# Altium schematic sheet Coil_Driver_Rev_A-3V_PCH-1.SchDoc: 3.3V, PCH
size B; Author: KR; DocumentNumber: 12282021; Revision: A; SheetNumber: 2; SheetTotal: 3; PageSetup: Record=PageOptions|CenterHorizontal=True|CenterVertical=True|PrintScale=0.95|XCorrection=1.00|YCorrection=1.00|PrintKind=1|BorderSize=5000000|LeftOffset=0|BottomOffset=0|Orientation=2|PaperLength=1000|PaperWidth=1000|Scale=100|PaperSource=7|PrintQuality=-4|MediaType=1|DitherType=10|PaperKind=Letter|PrintScaleMode=1
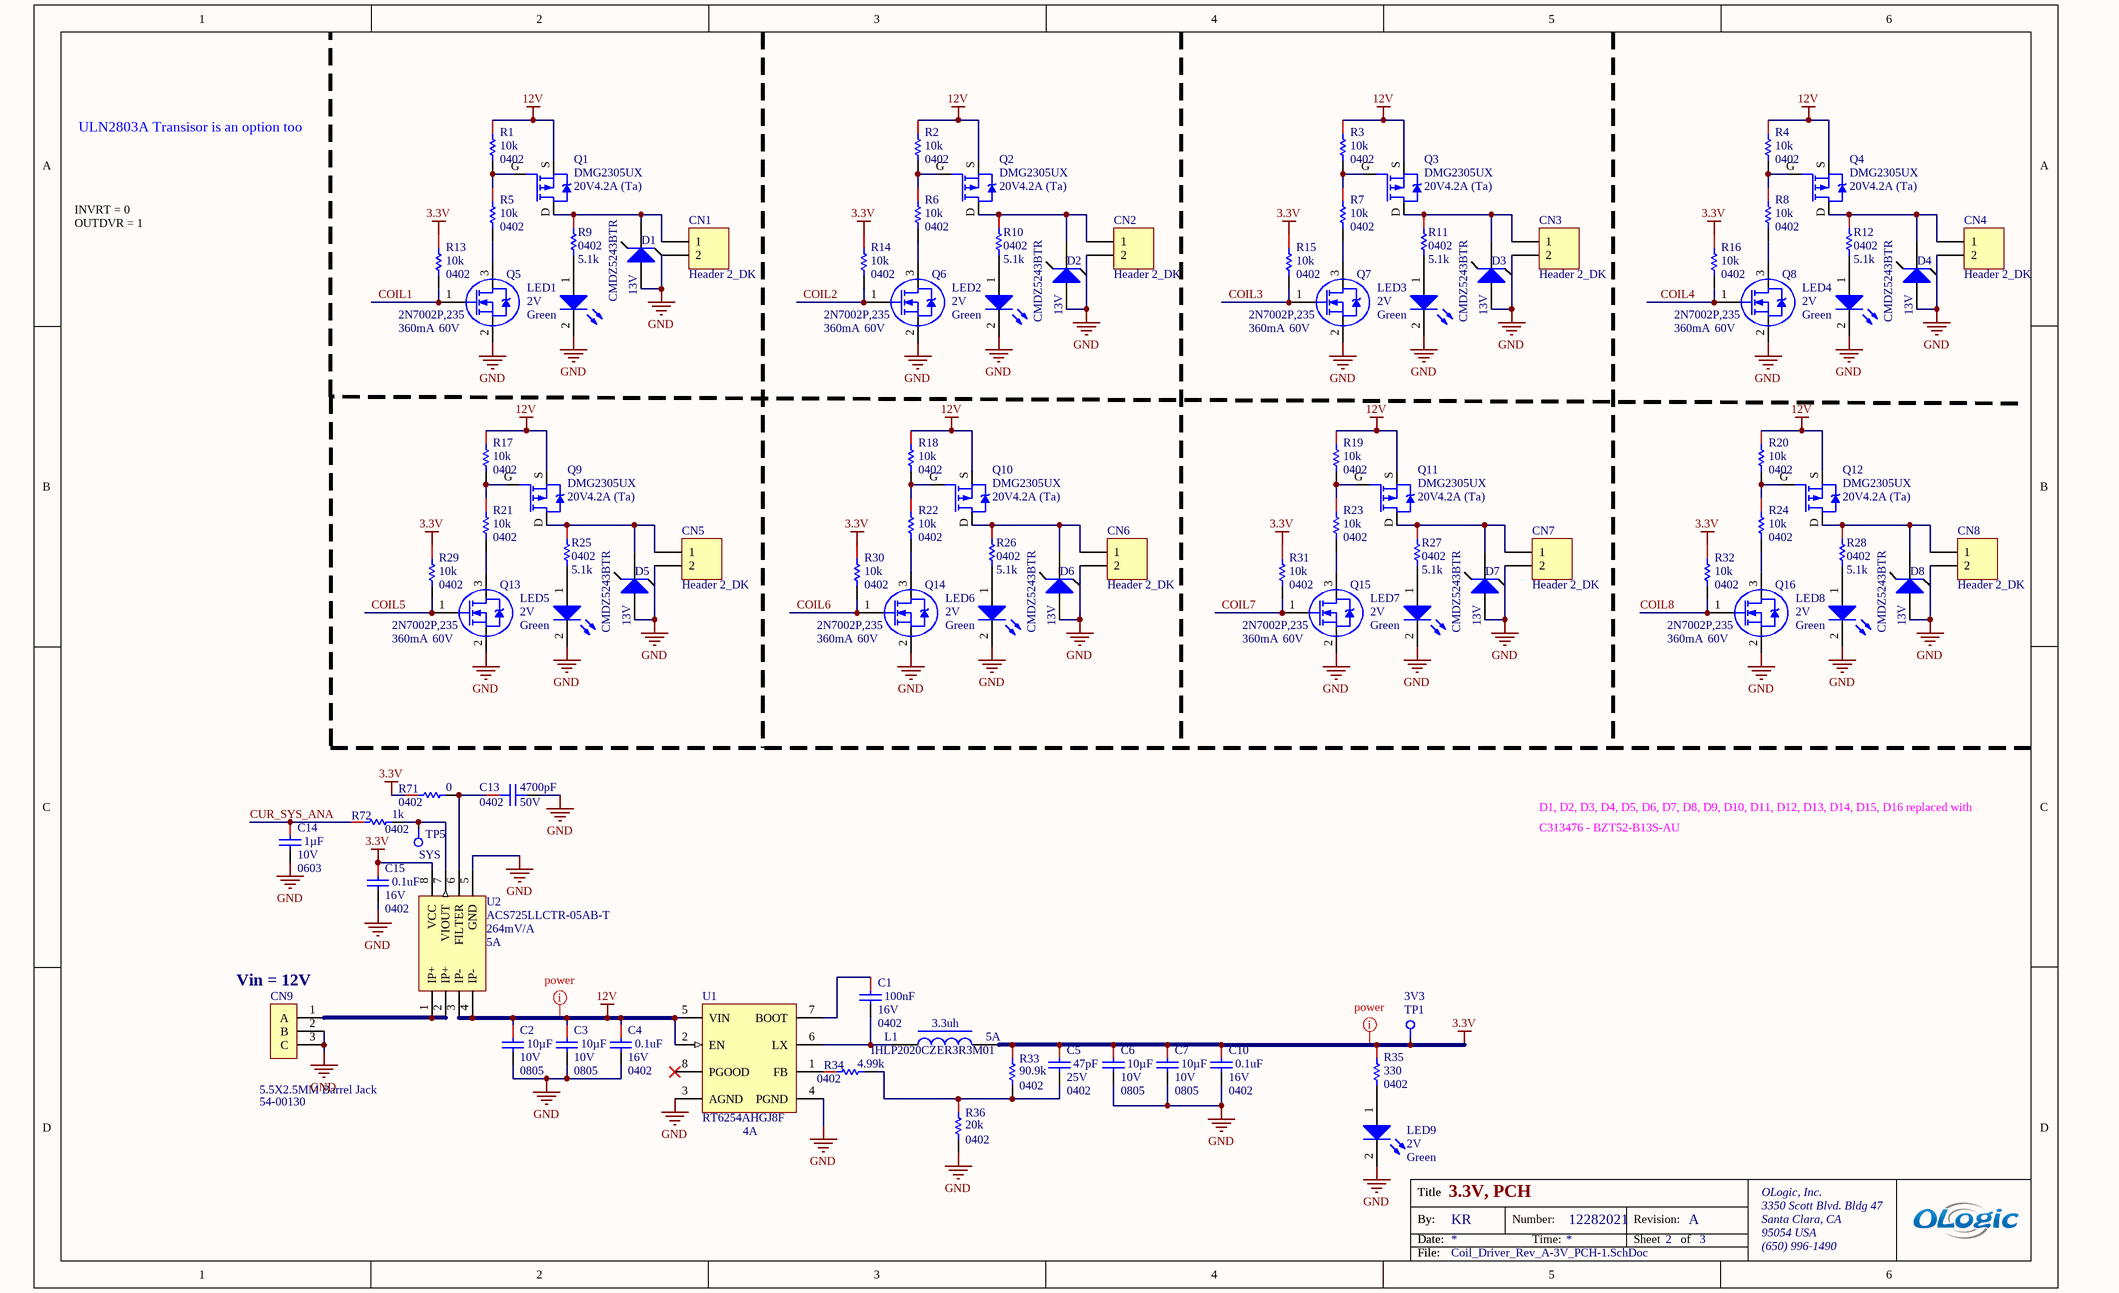
[diagram p0: Coil_Driver_Rev_A-3V_PCH-1.SchDoc]

## Parts
C1  Voltage (Rated): 16V  Package (Imperial): 0402  Capacitance: 100nF  [CAPC0402(1005)_L]  (hidden comment: CAP CER 0.1UF 16V X5R 0402)
C2  Voltage (Rated): 10V  Package (Imperial): 0805  Capacitance: 10µF  [CAPC0805(2012)_L]  (hidden comment: CAP CER 10UF 10V X7R 0805)
C3  Voltage (Rated): 10V  Package (Imperial): 0805  Capacitance: 10µF  [CAPC0805(2012)_L]  (hidden comment: CAP CER 10UF 10V X7R 0805)
C4  Package (Imperial): 0402  Voltage (Rated): 16V  Capacitance: 0.1uF  [CAPC0402(1005)_L]  (hidden comment: CAP CER 0.1UF 16V X5R 0402)
C5  Package (Imperial): 0402  Voltage (Rated): 25V  Capacitance: 47pF  [CAPC0402(1005)_L]  (hidden comment: CAP CER 47PF 25V C0G/NP0 0402)
C6  Voltage (Rated): 10V  Package (Imperial): 0805  Capacitance: 10µF  [CAPC0805(2012)_L]  (hidden comment: CAP CER 10UF 10V X7R 0805)
C7  Voltage (Rated): 10V  Package (Imperial): 0805  Capacitance: 10µF  [CAPC0805(2012)_L]  (hidden comment: CAP CER 10UF 10V X7R 0805)
C10  Package (Imperial): 0402  Voltage (Rated): 16V  Capacitance: 0.1uF  [CAPC0402(1005)_L]  (hidden comment: CAP CER 0.1UF 16V X5R 0402)
C13  4700pF  Voltage (Rated): 50V  Package (Imperial): 0402  [CAPC0402(1005)_N]
C14  Capacitance: 1µF  Voltage (Rated): 10V  Package (Imperial): 0603  [CAPC0603(1608)_L]  (hidden comment: 1uF)
C15  0.1uF  Voltage (Rated): 16V  Package (Imperial): 0402  [CAPC0402(1005)_L]
CN1  Header 2_DK  [HDR1X2]
CN2  Header 2_DK  [HDR1X2]
CN3  Header 2_DK  [HDR1X2]
CN4  Header 2_DK  [HDR1X2]
CN5  Header 2_DK  [HDR1X2]
CN6  Header 2_DK  [HDR1X2]
CN7  Header 2_DK  [HDR1X2]
CN8  Header 2_DK  [HDR1X2]
CN9  5.5X2.5MM Barrel Jack  [54-00130]
D1  CMDZ5243BTR  Zener Voltage: 13V  [SOD-323]
D2  CMDZ5243BTR  Zener Voltage: 13V  [SOD-323]
D3  CMDZ5243BTR  Zener Voltage: 13V  [SOD-323]
D4  CMDZ5243BTR  Zener Voltage: 13V  [SOD-323]
D5  CMDZ5243BTR  Zener Voltage: 13V  [SOD-323]
D6  CMDZ5243BTR  Zener Voltage: 13V  [SOD-323]
D7  CMDZ5243BTR  Zener Voltage: 13V  [SOD-323]
D8  CMDZ5243BTR  Zener Voltage: 13V  [SOD-323]
L1  IHLP2020CZER3R3M01  Inductance: 3.3uh  Current Rating: 5A  [INDP5252X30N]
LED1  Voltage - Forward (Vf) (Typ): 2V  Color: Green  [SM-LED-0603]  (hidden comment: LTST-C191KGKT)
LED2  Voltage - Forward (Vf) (Typ): 2V  Color: Green  [SM-LED-0603]  (hidden comment: LTST-C191KGKT)
LED3  Voltage - Forward (Vf) (Typ): 2V  Color: Green  [SM-LED-0603]  (hidden comment: LTST-C191KGKT)
LED4  Voltage - Forward (Vf) (Typ): 2V  Color: Green  [SM-LED-0603]  (hidden comment: LTST-C191KGKT)
LED5  Voltage - Forward (Vf) (Typ): 2V  Color: Green  [SM-LED-0603]  (hidden comment: LTST-C191KGKT)
LED6  Voltage - Forward (Vf) (Typ): 2V  Color: Green  [SM-LED-0603]  (hidden comment: LTST-C191KGKT)
LED7  Voltage - Forward (Vf) (Typ): 2V  Color: Green  [SM-LED-0603]  (hidden comment: LTST-C191KGKT)
LED8  Voltage - Forward (Vf) (Typ): 2V  Color: Green  [SM-LED-0603]  (hidden comment: LTST-C191KGKT)
LED9  Voltage - Forward (Vf) (Typ): 2V  Color: Green  [SM-LED-0603]  (hidden comment: LTST-C191KGKT)
Q1  DMG2305UX  Current - Continuous Drain (Id) @ 25°C: 4.2A (Ta)  Drain to Source Voltage (Vdss): 20V  [DMG2305UX-7]
Q2  DMG2305UX  Current - Continuous Drain (Id) @ 25°C: 4.2A (Ta)  Drain to Source Voltage (Vdss): 20V  [DMG2305UX-7]
Q3  DMG2305UX  Current - Continuous Drain (Id) @ 25°C: 4.2A (Ta)  Drain to Source Voltage (Vdss): 20V  [DMG2305UX-7]
Q4  DMG2305UX  Current - Continuous Drain (Id) @ 25°C: 4.2A (Ta)  Drain to Source Voltage (Vdss): 20V  [DMG2305UX-7]
Q5  2N7002P,235  Continuous Drain Current (ID): 360mA  Drain to Source Voltage (Vdss): 60V  [SOT23-3L]
Q6  2N7002P,235  Continuous Drain Current (ID): 360mA  Drain to Source Voltage (Vdss): 60V  [SOT23-3L]
Q7  2N7002P,235  Continuous Drain Current (ID): 360mA  Drain to Source Voltage (Vdss): 60V  [SOT23-3L]
Q8  2N7002P,235  Continuous Drain Current (ID): 360mA  Drain to Source Voltage (Vdss): 60V  [SOT23-3L]
Q9  DMG2305UX  Current - Continuous Drain (Id) @ 25°C: 4.2A (Ta)  Drain to Source Voltage (Vdss): 20V  [DMG2305UX-7]
Q10  DMG2305UX  Current - Continuous Drain (Id) @ 25°C: 4.2A (Ta)  Drain to Source Voltage (Vdss): 20V  [DMG2305UX-7]
Q11  DMG2305UX  Current - Continuous Drain (Id) @ 25°C: 4.2A (Ta)  Drain to Source Voltage (Vdss): 20V  [DMG2305UX-7]
Q12  DMG2305UX  Current - Continuous Drain (Id) @ 25°C: 4.2A (Ta)  Drain to Source Voltage (Vdss): 20V  [DMG2305UX-7]
Q13  2N7002P,235  Continuous Drain Current (ID): 360mA  Drain to Source Voltage (Vdss): 60V  [SOT23-3L]
Q14  2N7002P,235  Continuous Drain Current (ID): 360mA  Drain to Source Voltage (Vdss): 60V  [SOT23-3L]
Q15  2N7002P,235  Continuous Drain Current (ID): 360mA  Drain to Source Voltage (Vdss): 60V  [SOT23-3L]
Q16  2N7002P,235  Continuous Drain Current (ID): 360mA  Drain to Source Voltage (Vdss): 60V  [SOT23-3L]
R1  Resistance: 10k  Case Code (Imperial): 0402  [RESC0402(1005)_L]  (hidden comment: RES 10K OHM 0.1% 1/16W 0402)
R2  Resistance: 10k  Case Code (Imperial): 0402  [RESC0402(1005)_L]  (hidden comment: RES 10K OHM 0.1% 1/16W 0402)
R3  Resistance: 10k  Case Code (Imperial): 0402  [RESC0402(1005)_L]  (hidden comment: RES 10K OHM 0.1% 1/16W 0402)
R4  Resistance: 10k  Case Code (Imperial): 0402  [RESC0402(1005)_L]  (hidden comment: RES 10K OHM 0.1% 1/16W 0402)
R5  Resistance: 10k  Case Code (Imperial): 0402  [RESC0402(1005)_L]  (hidden comment: RES 10K OHM 0.1% 1/16W 0402)
R6  Resistance: 10k  Case Code (Imperial): 0402  [RESC0402(1005)_L]  (hidden comment: RES 10K OHM 0.1% 1/16W 0402)
R7  Resistance: 10k  Case Code (Imperial): 0402  [RESC0402(1005)_L]  (hidden comment: RES 10K OHM 0.1% 1/16W 0402)
R8  Resistance: 10k  Case Code (Imperial): 0402  [RESC0402(1005)_L]  (hidden comment: RES 10K OHM 0.1% 1/16W 0402)
R9  Package (Imperial): 0402  [RESC0402(1005)_L]  (hidden comment: 5.1K)
R10  Package (Imperial): 0402  [RESC0402(1005)_L]  (hidden comment: 5.1K)
R11  Package (Imperial): 0402  [RESC0402(1005)_L]  (hidden comment: 5.1K)
R12  Package (Imperial): 0402  [RESC0402(1005)_L]  (hidden comment: 5.1K)
R13  Resistance: 10k  Case Code (Imperial): 0402  [RESC0402(1005)_L]  (hidden comment: RES 10K OHM 0.1% 1/16W 0402)
R14  Resistance: 10k  Case Code (Imperial): 0402  [RESC0402(1005)_L]  (hidden comment: RES 10K OHM 0.1% 1/16W 0402)
R15  Resistance: 10k  Case Code (Imperial): 0402  [RESC0402(1005)_L]  (hidden comment: RES 10K OHM 0.1% 1/16W 0402)
R16  Resistance: 10k  Case Code (Imperial): 0402  [RESC0402(1005)_L]  (hidden comment: RES 10K OHM 0.1% 1/16W 0402)
R17  Resistance: 10k  Case Code (Imperial): 0402  [RESC0402(1005)_L]  (hidden comment: RES 10K OHM 0.1% 1/16W 0402)
R18  Resistance: 10k  Case Code (Imperial): 0402  [RESC0402(1005)_L]  (hidden comment: RES 10K OHM 0.1% 1/16W 0402)
R19  Resistance: 10k  Case Code (Imperial): 0402  [RESC0402(1005)_L]  (hidden comment: RES 10K OHM 0.1% 1/16W 0402)
R20  Resistance: 10k  Case Code (Imperial): 0402  [RESC0402(1005)_L]  (hidden comment: RES 10K OHM 0.1% 1/16W 0402)
R21  Resistance: 10k  Case Code (Imperial): 0402  [RESC0402(1005)_L]  (hidden comment: RES 10K OHM 0.1% 1/16W 0402)
R22  Resistance: 10k  Case Code (Imperial): 0402  [RESC0402(1005)_L]  (hidden comment: RES 10K OHM 0.1% 1/16W 0402)
R23  Resistance: 10k  Case Code (Imperial): 0402  [RESC0402(1005)_L]  (hidden comment: RES 10K OHM 0.1% 1/16W 0402)
R24  Resistance: 10k  Case Code (Imperial): 0402  [RESC0402(1005)_L]  (hidden comment: RES 10K OHM 0.1% 1/16W 0402)
R25  Package (Imperial): 0402  [RESC0402(1005)_L]  (hidden comment: 5.1K)
R26  Package (Imperial): 0402  [RESC0402(1005)_L]  (hidden comment: 5.1K)
R27  Package (Imperial): 0402  [RESC0402(1005)_L]  (hidden comment: 5.1K)
R28  Package (Imperial): 0402  [RESC0402(1005)_L]  (hidden comment: 5.1K)
R29  Resistance: 10k  Case Code (Imperial): 0402  [RESC0402(1005)_L]  (hidden comment: RES 10K OHM 0.1% 1/16W 0402)
R30  Resistance: 10k  Case Code (Imperial): 0402  [RESC0402(1005)_L]  (hidden comment: RES 10K OHM 0.1% 1/16W 0402)
R31  Resistance: 10k  Case Code (Imperial): 0402  [RESC0402(1005)_L]  (hidden comment: RES 10K OHM 0.1% 1/16W 0402)
R32  Resistance: 10k  Case Code (Imperial): 0402  [RESC0402(1005)_L]  (hidden comment: RES 10K OHM 0.1% 1/16W 0402)
R33  Package (Imperial): 0402  Resistance: 90.9k  [RESC0402(1005)_L]  (hidden comment: RES 90.9K OHM 1% 1/16W 0402)
R34  Package (Imperial): 0402  [RESC0402(1005)_L]  (hidden comment: 4.99K)
R35  Package (Imperial): 0402  [RESC0402(1005)_L]  (hidden comment: 330)
R36  Package (Imperial): 0402  [RESC0402(1005)_L]  (hidden comment: 20K)
R71  Package (Imperial): 0402  Resistance: 0  [RESC0402(1005)_N]  (no BOM)
R72  Package (Imperial): 0402  [RESC0402(1005)_N]  (hidden comment: 1K)
TP1  3V3  [Pogo-Testpoint]  (no BOM)
TP5  SYS  [Pogo-Testpoint]  (no BOM)
U1  RT6254AHGJ8F  Output Current: 4A  [TSOT-23-8]
U2  ACS725LLCTR-05AB-T  Sensitivity: 264mV/A  Current - Sensing: 5A  [SOG.050/8A]

## Nets
3.3V: C5.1 C6.1 C7.1 C10.1 C15.1 L1.2 R13.1 R14.1 R15.1 R16.1 R29.1 R30.1 R31.1 R32.1 R33.1 R35.1 R71.1 TP1.1 U2.8(VCC)
12V: C2.1 C3.1 C4.1 Q1.S Q2.S Q3.S Q4.S Q9.S Q10.S Q11.S Q12.S R1.1 R2.1 R3.1 R4.1 R17.1 R18.1 R19.1 R20.1 U1.2(EN) U1.5(VIN) U2.3(IP-) U2.4(IP-)
GND: C2.2 C3.2 C4.2 C6.2 C7.2 C10.2 C13.2 C14.2 C15.2 CN1.2 CN2.2 CN3.2 CN4.2 CN5.2 CN6.2 CN7.2 CN8.2 CN9.2(B) CN9.3(C) D1.2(A) D2.2(A) D3.2(A) D4.2(A) D5.2(A) D6.2(A) D7.2(A) D8.2(A) LED1.2(K) LED2.2(K) LED3.2(K) LED4.2(K) LED5.2(K) LED6.2(K) LED7.2(K) LED8.2(K) LED9.2(K) Q5.2(S) Q6.2(S) Q7.2(S) Q8.2(S) Q13.2(S) Q14.2(S) Q15.2(S) Q16.2(S) R36.2 U1.3(AGND) U1.4(PGND) U2.5(GND)
COIL1: Q5.1(G) R13.2
COIL2: Q6.1(G) R14.2
COIL3: Q7.1(G) R15.2
COIL4: Q8.1(G) R16.2
COIL5: Q13.1(G) R29.2
COIL6: Q14.1(G) R30.2
COIL7: Q15.1(G) R31.2
COIL8: Q16.1(G) R32.2
CUR_SYS_ANA: C14.1 R72.1
NetC1_1: C1.1 U1.7(BOOT)
NetC1_2: C1.2 L1.1 U1.6(LX)
NetC5_2: C5.2 R33.2 R34.2 R36.1
NetC13_1: C13.1 R71.2 U2.6(FILTER)
NetCN1_1: CN1.1 D1.1(K) Q1.D R9.1
NetCN2_1: CN2.1 D2.1(K) Q2.D R10.1
NetCN3_1: CN3.1 D3.1(K) Q3.D R11.1
NetCN4_1: CN4.1 D4.1(K) Q4.D R12.1
NetCN5_1: CN5.1 D5.1(K) Q9.D R25.1
NetCN6_1: CN6.1 D6.1(K) Q10.D R26.1
NetCN7_1: CN7.1 D7.1(K) Q11.D R27.1
NetCN8_1: CN8.1 D8.1(K) Q12.D R28.1
NetCN9_1: CN9.1(A) U2.1(IP+) U2.2(IP+)
NetLED1_1: LED1.1(A) R9.2
NetLED2_1: LED2.1(A) R10.2
NetLED3_1: LED3.1(A) R11.2
NetLED4_1: LED4.1(A) R12.2
NetLED5_1: LED5.1(A) R25.2
NetLED6_1: LED6.1(A) R26.2
NetLED7_1: LED7.1(A) R27.2
NetLED8_1: LED8.1(A) R28.2
NetLED9_1: LED9.1(A) R35.2
NetQ1_G: Q1.G R1.2 R5.1
NetQ2_G: Q2.G R2.2 R6.1
NetQ3_G: Q3.G R3.2 R7.1
NetQ4_G: Q4.G R4.2 R8.1
NetQ5_3: Q5.3(D) R5.2
NetQ6_3: Q6.3(D) R6.2
NetQ7_3: Q7.3(D) R7.2
NetQ8_3: Q8.3(D) R8.2
NetQ9_G: Q9.G R17.2 R21.1
NetQ10_G: Q10.G R18.2 R22.1
NetQ11_G: Q11.G R19.2 R23.1
NetQ12_G: Q12.G R20.2 R24.1
NetQ13_3: Q13.3(D) R21.2
NetQ14_3: Q14.3(D) R22.2
NetQ15_3: Q15.3(D) R23.2
NetQ16_3: Q16.3(D) R24.2
NetR34_1: R34.1 U1.1(FB)
NetR72_2: R72.2 TP5.1 U2.7(VIOUT)

Not connected (* = marked no-connect by the designer): U1 8(PGOOD)*

## Layout directives
net class power: 3.3V, 12V

## Notes on the sheet
- ULN2803A Transisor is an option too
- INVRT = 0
  OUTDVR = 1
- D1, D2, D3, D4, D5, D6, D7, D8, D9, D10, D11, D12, D13, D14, D15, D16 replaced with
- C313476 - BZT52-B13S-AU
- (near CN9) Vin = 12V
- Title
- By:
- Date:
- Number:
- Time:
- Revision:
- Sheet
- of
- OLogic, Inc.
- 3350 Scott Blvd. Bldg 47
- Santa Clara, CA
- 95054 USA
- File:
- (650) 996-1490

## Library data of the parts
C1 = CMP-001-0605-17: ±10% 16V Ceramic Capacitor X5R 0402 (1005 Metric); Manufacturer: Taiyo Yuden; Manufacturer Part Number: EMK105BJ104KV-F; Temperature (Min): -55°C; Temperature (Max): 85°C; Package (Metric): 1005; Height: 550µm; Temperature Coefficient: X5R; Tolerance: 10%; Width: 500µm; Mounting Type: SMD; Length: 1mm; Dielectric Material: Ceramic; Supplier: Digi-Key; Supplier Part Number: 587-1226-1-ND
C2 C3 C6 C7 = CMP-001-0889-04: 10µF ±10% 10V Ceramic Capacitor X7R 0805 (2012 Metric); Manufacturer Part Number: GRM21BR71A106KA73K; Package (Metric): 2012; Voltage Rating: 10V; Length: 2mm; Mounting Type: SMD; Height: 1.4mm; Mount: Surface Mount; Case Code (Metric): 2012; Min Operating Temperature: -55°C; Ratings: AEC-Q200; Width: 1.25mm; Packaging: Tape and Reel; Tolerance: 10%; Temperature Coefficient: X7R; Case Code (Imperial): 0805; Max Operating Temperature: 125°C; Case/Package: 0805; Dielectric Material: Ceramic
C4 C10 = CMP-001-0605-17: ±10% 16V Ceramic Capacitor X5R 0402 (1005 Metric); Manufacturer: Taiyo Yuden; Manufacturer Part Number: EMK105BJ104KV-F; Package (Metric): 1005; Temperature (Max): 85°C; Temperature (Min): -55°C; Height: 550µm; Supplier: Digi-Key; Supplier Part Number: 587-1226-1-ND; Tolerance: 10%; Dielectric Material: Ceramic; Temperature Coefficient: X5R; Width: 500µm; Length: 1mm; Mounting Type: SMD
C5 = CMP-001-1119-02: 47pF ±5% 25V Ceramic Capacitor C0G, NP0 0402 (1005 Metric); Manufacturer Part Number: C0402C470J3GACTU; Depth: 0.5mm; Min Operating Temperature: -55°C; Case Code (Metric): 1005; Width: 0.02inch; Thickness: 0.022inch; Lead Pitch: 0.3mm; Max Operating Temperature: 125°C; Length: 1mm; Height: 0.5mm; REACH SVHC: No SVHC; Case/Package: 0402; Package Quantity: 10000; Voltage Rating (DC): 25V; Dielectric Material: Ceramic; Lead Free: Lead Free; Dielectric: C0G; Packaging: Tape and Reel; Termination: SMD/SMT; Radiation Hardening: No; Tolerance: 5%; Mount: Surface Mount; ClassName: 3.3VEXP
C13 = CMP-007-0152-08: CAP CER 4700PF 50V X7R 0402; Capacitance: 4.7nF; Tolerance: 10%; Dielectric Material: Ceramic; Package (Metric): 1005; Temperature Coefficient: X7R; Mounting Type: SMD
C14 = CMP-001-0893-01: PREFERRED (<3.3V): CAP CER 1UF 10V X7R 0603; Dielectric Material: Ceramic; Dissipation Factor: 5%; Package (Metric): 1608; Tolerance: 10%; Depth: 0.8mm; Mount: Surface Mount; Case/Package: 0603; Dielectric: X7R; Case Code (Imperial): 0603; Packaging: Tape and Reel; Case Code (Metric): 1608; Height: 800µm; Contact Plating: Tin,Matte; Package Quantity: 1; Temperature Coefficient: X7R; Max Operating Temperature: 125°C; Termination: SMD/SMT; REACH SVHC: No SVHC; Width: 800µm; Voltage Rating: 10V; Min Operating Temperature: -55°C; Voltage Rating (DC): 10V; Thickness: 0.035inch; Length: 1.6mm; Mounting Type: SMD; Radiation Hardening: No; ClassName: CPU
C15 = CMP-001-0605-16: CAP CER 0.1UF 16v X7R 0402; Temperature (Min): -55°C; Temperature (Max): 85°C; Tolerance: 10%; Capacitance: 100nF; Package (Metric): 1005; Dielectric Material: Ceramic; Height: 500µm; Temperature Coefficient: X7R; Mounting Type: SMD; Length: 1mm
CN1-CN8 = CMP-001-0280-01: Header, 2-Pin; Manufacturer Part Number: 826936-2; Manufacturer: TE Connectivity AMP Connectors; Number of Positions: 2; Connector Type: Header, Unshrouded, Breakaway; Number of Positions Loaded: All; Features: -; Packaging: Bulk; Component Name: Header 2_DK; Color: Green; Stock 1: 32894; ComponentLink1Description: http://www.te.com/commerce/DocumentDelivery/DDEController?Action=srchrtrv&DocNm=826629&DocType=Customer+Drawing&DocLang=English; RoHS: RoHS Compliant; Contact Type: Male Pin; Fastening Type: -; Number of Rows: 1; Designator: Header 2_DK; Termination: Solder; Part Status: Active; ComponentLink1URL: http://www.te.com/commerce/DocumentDelivery/DDEController?Action=srchrtrv&DocNm=826629&DocType=Customer+Drawing&DocLang=English; Contact Finish Thickness: 78.7µin (2.00µm); Pricing 1: 1=0.23, 10=0.211, 25=0.18, 50=0.1576, 100=0.1463, 250=0.12944, 500=0.1238, 1000=0.10129, 2500=0.09284 (USD); Row Spacing: -; Pin Count: 2; Mounting Type: Through Hole; Contact Finish: Tin
CN9 = CMP-001-1647-02: CONN JACK R/A PCB 5.5X2.5MM; Manufacturer: Tensility International Corp; Body Material: Copper Alloy; Voltage Rating: 48V; Shielding: Unshielded; Gender: Male; Current Rating: 6.5A; Housing Material: PBT; Contact Plating: Silver; Packaging: Bulk; Mount: Through Hole; Connector Type: Jack; Max Operating Temperature: 85°C; Manufacturer Part Number: 54-00130; Min Operating Temperature: -25°C; Insulation Color: Black; Termination: Solder; Contact Material: Bronze,Brass
D1-D8 = CMP-001-0939-01: DIODE ZENER 13V 250MW SOD323; Tolerance: 5%; Impedance: 13R; Max Operating Temperature: 150°C; Max Power Dissipation: 250mW; Packaging: Tape and Reel; Min Operating Temperature: -65°C; Mount: Surface Mount
L1 = CMP-001-0659-01: FIXED IND 3.3UH 5A 54.7 MOHM SMD; Tolerance: 20%; Max DC Current: 8.5A; Self Resonant Frequency: 5MHz; Core Material: Composite, Metal; DC Resistance (DCR): 54.7mR; Shielding: Shielded; Test Frequency: 100kHz; Height - Seated (Max): 0.118inch; Inductance Tolerance: 20%; Lead Free: Lead Free; Mount: Surface Mount; Termination: SMD/SMT; Length: 5.74mm; Depth: 5.43mm; Height: 3mm; Packaging: Tape and Reel; Max Operating Temperature: 125°C; Saturation Current: 8.5A; Case/Package: 2020; Military Standard: Not; Package Quantity: 2000; Width: 0.204inch; REACH SVHC: Unknown; Min Operating Temperature: -55°C; Contact Plating: Tin; Radiation Hardening: No; RMS Current (Irms): 5A
LED1-LED8 = CMP-001-0086-07: LED GREEN CLEAR THIN 0603 SMD; Manufacturer: Lite-On Inc; Viewing Angle: 130°; Wavelength - Peak: 574nm; Wavelength - Dominant: 571nm; Current - Test: 20mA; Millicandela Rating: 35mcd; Lens Style/Size: Rectangle with Flat Top, 1.1mm x 0.8mm; Pin Count: 2; Packaging: Cut Tape (CT); Height: 0.55mm; Size / Dimension: 1.60mm L x 0.80mm W; Mounting Type: Surface Mount; ClassName: *; RoHS: RoHS Compliant; Pricing 1: 1=0.3, 10=0.238, 100=0.1296, 250=0.0864, 500=0.07344, 1000=0.05616, 2500=0.05076 (USD); Lens Type: Clear; Manufacturer Part Number: LTST-C191KGKT; Stock 1: 84829; Package / Case: 0603 (1608 Metric)
LED9 = CMP-001-0086-06: LED GREEN CLEAR THIN 0603 SMD; Manufacturer: Lite-On Inc; Viewing Angle: 130°; Wavelength - Peak: 574nm; Wavelength - Dominant: 571nm; Current - Test: 20mA; Millicandela Rating: 35mcd; Lens Style/Size: Rectangle with Flat Top, 1.1mm x 0.8mm; Pin Count: 2; Packaging: Cut Tape (CT); Height: 0.55mm; Size / Dimension: 1.60mm L x 0.80mm W; Mounting Type: Surface Mount; ClassName: *; RoHS: RoHS Compliant; Pricing 1: 1=0.3, 10=0.238, 100=0.1296, 250=0.0864, 500=0.07344, 1000=0.05616, 2500=0.05076 (USD); Lens Type: Clear; Manufacturer Part Number: LTST-C191KGKT; Stock 1: 84829; Package / Case: 0603 (1608 Metric)
Q1-Q4 Q9-Q12 = CMP-012-0038-02: MOSFET P-CH 20V 4.2A SOT23; Manufacturer: Diodes Incorporated; Input Capacitance (Ciss) @ Vds: 808pF @ 15V; FET Type: MOSFET P-Channel, Metal Oxide; Power - Max: 1.4W; FET Feature: Standard; Rds On (Max) @ Id, Vgs: 52 mOhm @ 4.2A, 4.5V; Gate Charge (Qg) @ Vgs: 10.2nC @ 4.5V; Vgs(th) (Max) @ Id: 900mV @ 250µA; Manufacturer Part Number: DMG2305UX-7; ComponentLink1URL: http://www.diodes.com/_files/datasheets/DMG2305UX.pdf; ComponentLink1Description: http://www.diodes.com/_files/datasheets/DMG2305UX.pdf; Pricing 1: 1=0.38, 10=0.311, 100=0.1649, 500=0.10846, 1000=0.0739 (USD); Designator: DMG2305UX; Package / Case: TO-236-3, SC-59, SOT-23-3; Supplier Device Package: SOT-23; Component Name: DMG2305UX; Creator: osman; RoHS: RoHS Compliant; Packaging: Cut Tape (CT); Operating Temperature: -55°C ~ 150°C (TJ); Pin Count: 3; Mounting Type: Surface Mount; Stock 1: 78669
Q5-Q8 Q13-Q16 = CMP-012-0002-01: MOSFET N-CH 60V 0.36A SOT-23; Manufacturer: NXP Semiconductors; FET Type: N-Channel; Drain to Source Resistance: 1.6R; Power Dissipation (Max): 350mW (Ta); Gate to Source Voltage (Vgs): 20V; Vgs (Max): ±20V; Turn-Off Delay Time: 10ns; Input Capacitance: 50pF; Current - Continuous Drain (Id) @ 25°C: 360mA (Ta); Max Power Dissipation: 350mW; Drive Voltage (Max Rds On,  Min Rds On): 10V; Rise Time: 4ns; Fall Time: 5ns; Vgs(th) (Max) @ Id: 2.4V @ 250µA; Number of Elements: 1; Power Dissipation: 420mW; Rds On (Max) @ Id, Vgs: 1.6 Ohm @ 500mA, 10V; Turn-On Delay Time: 3ns; ComponentLink7Description: https://datasheet.ciiva.com/15216/getdatasheetpartid-496132-15216636.pdf; ComponentLink2Description: https://datasheet.ciiva.com/4439/2n7002p-99415-4439248.pdf; Contact Plating: Tin; ComponentLink3URL: https://datasheet.ciiva.com/6371/2n7002p-6371141.pdf; Stock 1: 109268; FET Feature: -; Case/Package: SOT; RoHS: RoHS Compliant; ComponentLink2URL: https://datasheet.ciiva.com/4439/2n7002p-99415-4439248.pdf; ComponentLink8URL: https://datasheet.ciiva.com/46633/discretesemiconductors-46633181.pdf; Number of Pins: 3; ComponentLink1Description: http://assets.nexperia.com/documents/data-sheet/2N7002P.pdf; Pricing 1: 1=0.14, 10=0.128, 100=0.07, 500=0.043, 1000=0.0294 (USD); Mounting Type: Surface Mount; Rds On Max: 1.6R; Package Quantity: 10000; Pricing 2: 1=0.16, 10=0.148, 100=0.0969, 500=0.04738, 1000=0.03231 (USD); Lead Free: Lead Free; ComponentLink4Description: https://datasheet.ciiva.com/49067/getdatasheetpartid-765733-49067862.pdf; ComponentLink4URL: https://datasheet.ciiva.com/49067/getdatasheetpartid-765733-49067862.pdf; Packaging: Tape and Reel; Max Dual Supply Voltage: 60V; Part Status: Active; ComponentLink1URL: http://assets.nexperia.com/documents/data-sheet/2N7002P.pdf; ComponentLink7URL: https://datasheet.ciiva.com/15216/getdatasheetpartid-496132-15216636.pdf; Component Name: 2N7002P,235; Pin Count: 3; Operating Temperature: -55°C ~ 150°C (TJ); Stock 2: 177811; ComponentLink3Description: https://datasheet.ciiva.com/6371/2n7002p-6371141.pdf; ComponentLink6Description: https://datasheet.ciiva.com/26921/getdatasheetpartid-765733-26921227.pdf; ComponentLink5Description: https://datasheet.ciiva.com/11168/2n7002p-11168552.pdf; ComponentLink9URL: https://assets.nexperia.com/documents/data-sheet/2N7002P.pdf; ComponentLink8Description: https://datasheet.ciiva.com/46633/discretesemiconductors-46633181.pdf; ComponentLink6URL: https://datasheet.ciiva.com/26921/getdatasheetpartid-765733-26921227.pdf; Package / Case: TO-236-3, SC-59, SOT-23-3; Min Operating Temperature: -55°C; Radiation Hardening: No; ComponentLink5URL: https://datasheet.ciiva.com/11168/2n7002p-11168552.pdf; Manufacturer Part Number: 2N7002P,235; Drain to Source Breakdown Voltage: 60V; Supplier Device Package: TO-236AB (SOT23); Designator: 2N7002P,235; Max Operating Temperature: 150°C; ComponentLink9Description: https://assets.nexperia.com/documents/data-sheet/2N7002P.pdf; Technology: MOSFET (Metal Oxide)
R1-R8 R13-R24 R29-R32 = CMP-001-0950-02: 10 kOhms ±0.1% 0.063W, 1/16W Chip Resistor 0402 (1005 Metric) Automotive AEC-Q200 Thin Film; Temperature Coefficient: 25ppm/°C; Max Power Dissipation: 63mW; Length: 0.039inch; Max Operating Temperature: 155°C; Min Operating Temperature: -55°C; Case/Package: 0402; Packaging: Tape and Reel; Tolerance: 0.1%; Width: 0.02inch; Contact Plating: Tin,Matte; Height: 0.016inch; Composition: Thin Film; Case Code (Metric): 1005; Package Quantity: 10000; Mount: Surface Mount; Radiation Hardening: No; Number of Terminations: 2; Features: Moisture Resistant
R9-R12 R25-R28 = CMP-007-0525-15: RES SMD 5.1K OHM 1% 1/10W 0402; Package (Metric): 1005; Max Power Dissipation: 100mW; Voltage Rating (DC): 50V; Power: 63mW; Temperature Coefficient: 100ppm/°C; Resistance: 5.1k; Termination: SMD/SMT; Lead Free: Lead Free; Mount: Surface Mount; Length: 1mm; Width: 500µm; Min Operating Temperature: -55°C; Contact Plating: Tin; Weight: 2.8E-05oz; Voltage Rating: 50V; Height: 350µm; Depth: 0.5mm; Military Standard: Not; Composition: Thick Film; Number of Terminations: 2; Packaging: Tape and Reel; Power Rating: 100mW; Tolerance: 1%; Package Quantity: 10000; Max Operating Temperature: 155°C; REACH SVHC: No SVHC
R33 = CMP-007-0589-13: 90.9 kOhms ±1% 0.063W, 1/16W Chip Resistor 0402 (1005 Metric) Automotive AEC-Q200 Thick Film; Temperature Coefficient: ±100ppm/°C; Power: 63mW; Package (Metric): 1005; Height: 400µm; Operating Temperature: -55°C ~ 155°C; Tolerance: 1%; Termination: SMD/SMT; Length: 1mm
R34 = CMP-00076-12: RES SMD 4.99K OHM 1% 1/16W 0402; Temperature Coefficient: 100ppm/°C; Power: 63mW; Package (Metric): 1005; Tolerance: 1%; Length: 1mm; Resistance: 4.99k; Termination: SMD/SMT; Height: 400µm
R35 = CMP-00021-18: RES SMD 330 OHM 1% 1/10W 0402; Package (Metric): 1005; Temperature Coefficient: 100ppm/°C; Power: 63mW; Termination: SMD/SMT; Resistance: 330; Length: 1mm; Height: 400µm; Tolerance: 1%
R36 = CMP-007-0427-12: RES 20K OHM 1% 1/10W 0402; Temperature Coefficient: ±100ppm/°C; Package (Metric): 1005; Power: 63mW; Resistance: 20k; Operating Temperature: -55°C ~ 155°C; Height: 400µm; Tolerance: 1%; Length: 1mm; Termination: SMD/SMT
R71 = CMP-007-0302-14: RES 0.0 OHM JUMPER 0402 1/10W SMD; Power: 63mW; Tolerance: 0%; Package (Metric): 1005; Termination: SMD/SMT; Operating Temperature: -55°C ~ 155°C; Height: 400µm; Temperature Coefficient: -; Length: 1mm
R72 = CMP-007-0405-12: RES 1K OHM 1% 1/16W 0402; Power: 63mW; Package (Metric): 1005; Temperature Coefficient: 100ppm/°C; Height: 400µm; Termination: SMD/SMT; Length: 1mm; Width: 500µm; Tolerance: 1%; Resistance: 1k
TP1 = CMP-001-0557-04: Test Point- Current one
TP5 = CMP-001-0557-03: Test Point- Current one; Pin Count: 1; Component Name: TestPoint; Designator: TestPoint
U1 = CMP-001-1377-03: IC REG BUCK ADJ 4A TSOT23-8; Max Input Voltage: 18V; Output Type: Adjustable; Number of Outputs: 1; Min Output Voltage: 600mV; Switching Frequency: 500kHz; Min Input Voltage: 4.5V; Synchronous Rectifier: Yes; Max Output Voltage: 5V; Output Configuration: Positive; Min Operating Temperature: -40°C; Manufacturer Part Number: RT6254AHGJ8F; Max Operating Temperature: 85°C
U2 = CMP-010-0118-03: Current Sensor 5A 1 Channel Hall Effect, Differential Bidirectional; Accuracy: 0.9%; Linearity: 1.5%; Response Time: 4µs; Frequency: DC ~ 120kHz; Voltage - Supply: 3V ~ 3.6V; Sensor Type: Hall Effect, Differential; Operating Temperature: -40°C ~ 150°C (TA); Polarization: Bidirectional